# Altium schematic sheet Overview.SchDoc: Overview
size Letter; Date: 2017-02-04; DocumentNumber: 1; Revision: C; SheetNumber: 1; SheetTotal: 16; DesignedBy: Craig Comberbach
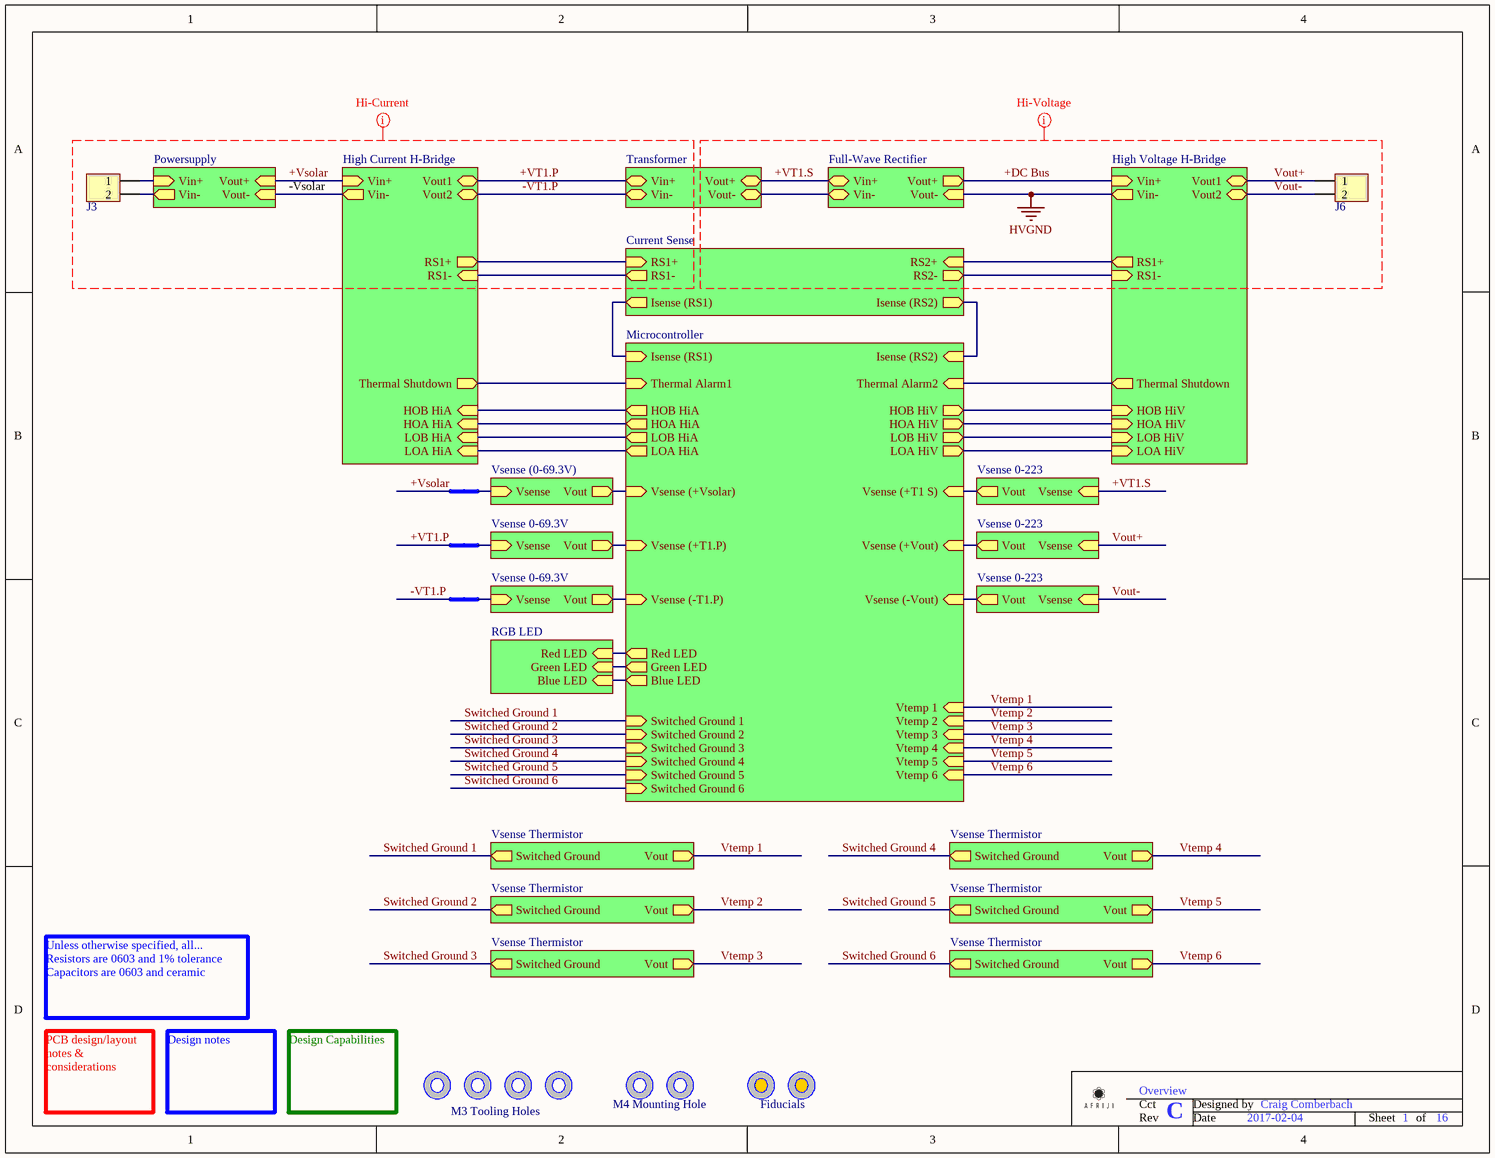
[diagram p0: Overview.SchDoc]

## Parts
FID1  Fiducials  [Fiducial]  (no BOM)
FID3  Fiducial  [Fiducial]  (value not drawn)  (no BOM)
J3  Terminal Block - 2-Position HiV/HiA  [TE 796739-2]  (value not drawn)
J6  Terminal Block - 2-Position HiV/HiA  [TE 796739-2]  (value not drawn)
MountingHole1  M3 Tooling Holes  [M3 Screw - One Sided]  (no BOM)
MountingHole2  Mounting Hole  [M3 Screw - One Sided]  (value not drawn)  (no BOM)
MountingHole3  Mounting Hole  [M4 Screw - One Sided]  (value not drawn)  (no BOM)
MountingHole4  M4 Mounting Hole  [M4 Screw - One Sided]  (no BOM)
MountingHole5  Mounting Hole  [M3 Screw - One Sided]  (value not drawn)  (no BOM)
MountingHole6  Mounting Hole  [M3 Screw - One Sided]  (value not drawn)  (no BOM)
NetTie7  Net Tie - Same Size  (value not drawn)  (net tie, no BOM)
NetTie8  Net Tie - Same Size  (value not drawn)  (net tie, no BOM)
NetTie9  Net Tie - Same Size  (value not drawn)  (net tie, no BOM)

## Sub-sheets
Current Sense = Current Sense.SchDoc: RS1+ (in), RS1- (out), RS2+ (in), RS2- (out), Isense (RS1) (out), Isense (RS2) (out)
Full-Wave Rectifier = Full-Wave Rectifier.SchDoc: Vin+ (bidir), Vin- (bidir), Vout+ (out), Vout- (in)
High Current H-Bridge = High Current H-Bridge.SchDoc: Vout1 (bidir), Vout2 (bidir), Vin+ (in), Vin- (out), RS1+ (out), RS1- (in), HOB HiA (in), LOB HiA (in), LOA HiA (in), HOA HiA (in), Thermal Shutdown (out)
High Voltage H-Bridge = High Voltage H-Bridge.SchDoc: Vout1 (bidir), Vout2 (bidir), Vin+ (in), Vin- (out), RS1+ (out), RS1- (in), HOB HiV (in), HOA HiV (in), LOA HiV (in), LOB HiV (in), Thermal Shutdown (out)
Microcontroller = Microcontroller.SchDoc: Red LED (out), Green LED (out), Blue LED (out), Vsense (+T1.P) (in), Vsense (+Vsolar) (in), Vsense (-T1.P) (in), Vsense (+T1 S) (in), Vtemp 6 (in), Vsense (+Vout) (in), Vsense (-Vout) (in), Vtemp 1 (in), Vtemp 2 (in), Vtemp 3 (in), Vtemp 4 (in), Vtemp 5 (in), Isense (RS1) (in), Isense (RS2) (in), Switched Ground 1 (in), Switched Ground 2 (in), Switched Ground 3 (in), Switched Ground 4 (in), Switched Ground 5 (in), HOB HiA (out), LOB HiA (out), LOA HiA (out), HOA HiA (out), HOB HiV (out), HOA HiV (out), LOA HiV (out), LOB HiV (out), Switched Ground 6 (in), Thermal Alarm1 (in), Thermal Alarm2 (in)
Powersupply = Powersupply.SchDoc: Vin+ (in), Vin- (out), Vout- (in), Vout+ (in)
RGB LED = RGB LED.SchDoc: Red LED (in), Green LED (in), Blue LED (in)
Transformer = Transformer.SchDoc: Vin+ (bidir), Vin- (bidir), Vout+ (bidir), Vout- (bidir)
Vsense 0-69.3V = Vsense 0-69.3V.SchDoc: Vsense (in), Vout (out)
Vsense 0-69.3V = Vsense 0-69.3V.SchDoc: Vsense (in), Vout (out)
Vsense 0-223 = Vsense 0-223.3V.SchDoc: Vsense (in), Vout (out)
Vsense 0-223 = Vsense 0-223.3V.SchDoc: Vsense (in), Vout (out)
Vsense 0-223 = Vsense 0-223.3V.SchDoc: Vsense (in), Vout (out)
Vsense (0-69.3V) = Vsense 0-69.3V.SchDoc: Vsense (in), Vout (out)
Vsense Thermistor = Vsense Thermistor.SchDoc: Switched Ground (out), Vout (out)
Vsense Thermistor = Vsense Thermistor.SchDoc: Switched Ground (out), Vout (out)
Vsense Thermistor = Vsense Thermistor.SchDoc: Switched Ground (out), Vout (out)
Vsense Thermistor = Vsense Thermistor.SchDoc: Switched Ground (out), Vout (out)
Vsense Thermistor = Vsense Thermistor.SchDoc: Switched Ground (out), Vout (out)
Vsense Thermistor = Vsense Thermistor.SchDoc: Switched Ground (out), Vout (out)

## Nets
HVGND: sheet Full-Wave Rectifier/Vout-, sheet High Voltage H-Bridge/Vin-
+DC Bus: sheet Full-Wave Rectifier/Vout+, sheet High Voltage H-Bridge/Vin+
+Vsolar: NetTie7.1 ; sheet High Current H-Bridge/Vin+, sheet Powersupply/Vout+
+VT1.P: NetTie8.1 ; sheet High Current H-Bridge/Vout1, sheet Transformer/Vin+
+VT1.S: sheet Full-Wave Rectifier/Vin+, sheet Transformer/Vout+, sheet Vsense 0-223/Vsense
-Vsolar: sheet High Current H-Bridge/Vin-, sheet Powersupply/Vout-
-VT1.P: NetTie9.1 ; sheet High Current H-Bridge/Vout2, sheet Transformer/Vin-
Switched Ground 1: sheet Microcontroller/Switched Ground 1, sheet Vsense Thermistor/Switched Ground
Switched Ground 2: sheet Microcontroller/Switched Ground 2, sheet Vsense Thermistor/Switched Ground
Switched Ground 3: sheet Microcontroller/Switched Ground 3, sheet Vsense Thermistor/Switched Ground
Switched Ground 4: sheet Microcontroller/Switched Ground 4, sheet Vsense Thermistor/Switched Ground
Switched Ground 5: sheet Microcontroller/Switched Ground 5, sheet Vsense Thermistor/Switched Ground
Switched Ground 6: sheet Microcontroller/Switched Ground 6, sheet Vsense Thermistor/Switched Ground
Vout+: J6.1 ; sheet High Voltage H-Bridge/Vout1, sheet Vsense 0-223/Vsense
Vout-: J6.2 ; sheet High Voltage H-Bridge/Vout2, sheet Vsense 0-223/Vsense
Vtemp 1: sheet Microcontroller/Vtemp 1, sheet Vsense Thermistor/Vout
Vtemp 2: sheet Microcontroller/Vtemp 2, sheet Vsense Thermistor/Vout
Vtemp 3: sheet Microcontroller/Vtemp 3, sheet Vsense Thermistor/Vout
Vtemp 4: sheet Microcontroller/Vtemp 4, sheet Vsense Thermistor/Vout
Vtemp 5: sheet Microcontroller/Vtemp 5, sheet Vsense Thermistor/Vout
Vtemp 6: sheet Microcontroller/Vtemp 6, sheet Vsense Thermistor/Vout
NetJ3_1: J3.1 ; sheet Powersupply/Vin+
NetJ3_2: J3.2 ; sheet Powersupply/Vin-
NetNetTie7_2: NetTie7.2 ; sheet Vsense (0-69.3V)/Vsense
NetNetTie8_2: NetTie8.2 ; sheet Vsense 0-69.3V/Vsense
NetNetTie9_2: NetTie9.2 ; sheet Vsense 0-69.3V/Vsense
(unnamed): sheet High Current H-Bridge/RS1+, sheet Current Sense/RS1+
(unnamed): sheet High Current H-Bridge/RS1-, sheet Current Sense/RS1-
(unnamed): sheet High Current H-Bridge/HOB HiA, sheet Microcontroller/HOB HiA
(unnamed): sheet High Current H-Bridge/LOB HiA, sheet Microcontroller/LOB HiA
(unnamed): sheet High Current H-Bridge/LOA HiA, sheet Microcontroller/LOA HiA
(unnamed): sheet High Current H-Bridge/HOA HiA, sheet Microcontroller/HOA HiA
(unnamed): sheet High Current H-Bridge/Thermal Shutdown, sheet Microcontroller/Thermal Alarm1
(unnamed): sheet Full-Wave Rectifier/Vin-, sheet Transformer/Vout-
(unnamed): sheet High Voltage H-Bridge/RS1+, sheet Current Sense/RS2+
(unnamed): sheet High Voltage H-Bridge/RS1-, sheet Current Sense/RS2-
(unnamed): sheet High Voltage H-Bridge/HOB HiV, sheet Microcontroller/HOB HiV
(unnamed): sheet High Voltage H-Bridge/HOA HiV, sheet Microcontroller/HOA HiV
(unnamed): sheet High Voltage H-Bridge/LOA HiV, sheet Microcontroller/LOA HiV
(unnamed): sheet High Voltage H-Bridge/LOB HiV, sheet Microcontroller/LOB HiV
(unnamed): sheet High Voltage H-Bridge/Thermal Shutdown, sheet Microcontroller/Thermal Alarm2
(unnamed): sheet Microcontroller/Red LED, sheet RGB LED/Red LED
(unnamed): sheet Microcontroller/Green LED, sheet RGB LED/Green LED
(unnamed): sheet Microcontroller/Blue LED, sheet RGB LED/Blue LED
(unnamed): sheet Microcontroller/Vsense (+T1.P), sheet Vsense 0-69.3V/Vout
(unnamed): sheet Microcontroller/Vsense (+Vsolar), sheet Vsense (0-69.3V)/Vout
(unnamed): sheet Microcontroller/Vsense (-T1.P), sheet Vsense 0-69.3V/Vout
(unnamed): sheet Microcontroller/Vsense (+T1 S), sheet Vsense 0-223/Vout
(unnamed): sheet Microcontroller/Vsense (+Vout), sheet Vsense 0-223/Vout
(unnamed): sheet Microcontroller/Vsense (-Vout), sheet Vsense 0-223/Vout
(unnamed): sheet Microcontroller/Isense (RS1), sheet Current Sense/Isense (RS1)
(unnamed): sheet Microcontroller/Isense (RS2), sheet Current Sense/Isense (RS2)

## Layout directives
net class 15A: +Vsolar, +VT1.P, -Vsolar, -VT1.P
net class 171-250V: +DC Bus, +VT1.S, HVGND, Vout+, Vout-

## Notes on the sheet
- Unless otherwise specified, all...
  Resistors are 0603 and 1% tolerance
  Capacitors are 0603 and ceramic
- PCB design/layout notes & considerations
- Design notes
- (near MountingHole1) Design Capabilities
- Cct
- Designed by
- Rev
- Date
- Sheet
- of

## Library data of the parts
FID1 = Fiducial: Value: Fiducial
J3 J6 = Terminal Block - 2-Position HiV/HiA: Manufacturer: TE Connectivity AMP Connectors; Manufacturer Part Number: 796739-2; Number of Levels: 1; Positions Per Level: 2; Pitch: 0.375" (9.53mm); Mating Orientation: Horizontal with Board; Current: 30A; Voltage: 600V; Wire Gauge: 10-30 AWG; Wire Termination: Screw - Rising Cage Clamp; Clamp Material - Plating: Brass - Nickel Plated; Torque - Screw: 0.79 Nm (7.0 Lb-In); Screw Thread: M3; Supplier 1: Digi-Key; RoHS: RoHS Compliant; Category: Connectors, Interconnects; Stock 1: 14124; Pricing 1: 1=2.21, 10=1.673, 25=1.5504, 50=1.394, 100=1.36, 250=1.19, 500=1.088, 1000=0.986, 2500=0.884 (USD); Packaging: Tray; Part Status: Active; Mounting Type: Through Hole; Features: Interlocking (Side); Color: Green; Operating Temperature: -; Housing Material: Polyamide (PA66), Nylon 6/6; Contact Material - Plating: -; Screw Material - Plating: Brass - Nickel Plated; ComponentLink1URL: http://www.te.com/commerce/DocumentDelivery/DDEController?Action=srchrtrv&DocNm=796739&DocType=Customer+Drawing&DocLang=English; ComponentLink1Description: Spec Sheet; Supplier Part Number 1: A98273-ND
MountingHole1 MountingHole4 = Mounting Hole
NetTie7-NetTie9 = Net Tie - Same Size: Ties two nets together
FID3 = Fiducial: Value: Fiducial